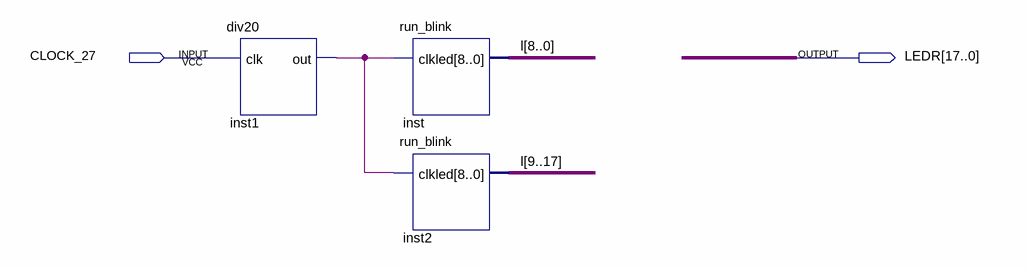
[diagram p0: schematic sheet]
// Quartus schematic test_block_2.bdf as structural Verilog: 3 symbols, 2 pins
module test_block_2 (
  input  CLOCK_27,
  output [17:0] LEDR
);

  wire inst1_out;
  wire [17:0] l;

  div20 inst1 (.clk(CLOCK_27), .out(inst1_out));
  run_blink inst (.clk(inst1_out), .led(l[8:0]));
  run_blink inst2 (.clk(inst1_out), .led({l[9], l[10], l[11], l[12], l[13], l[14], l[15], l[16], l[17]}));
endmodule
